# EAGLE design gatorBytes_Sensor_board (EAGLE 9.1.0)
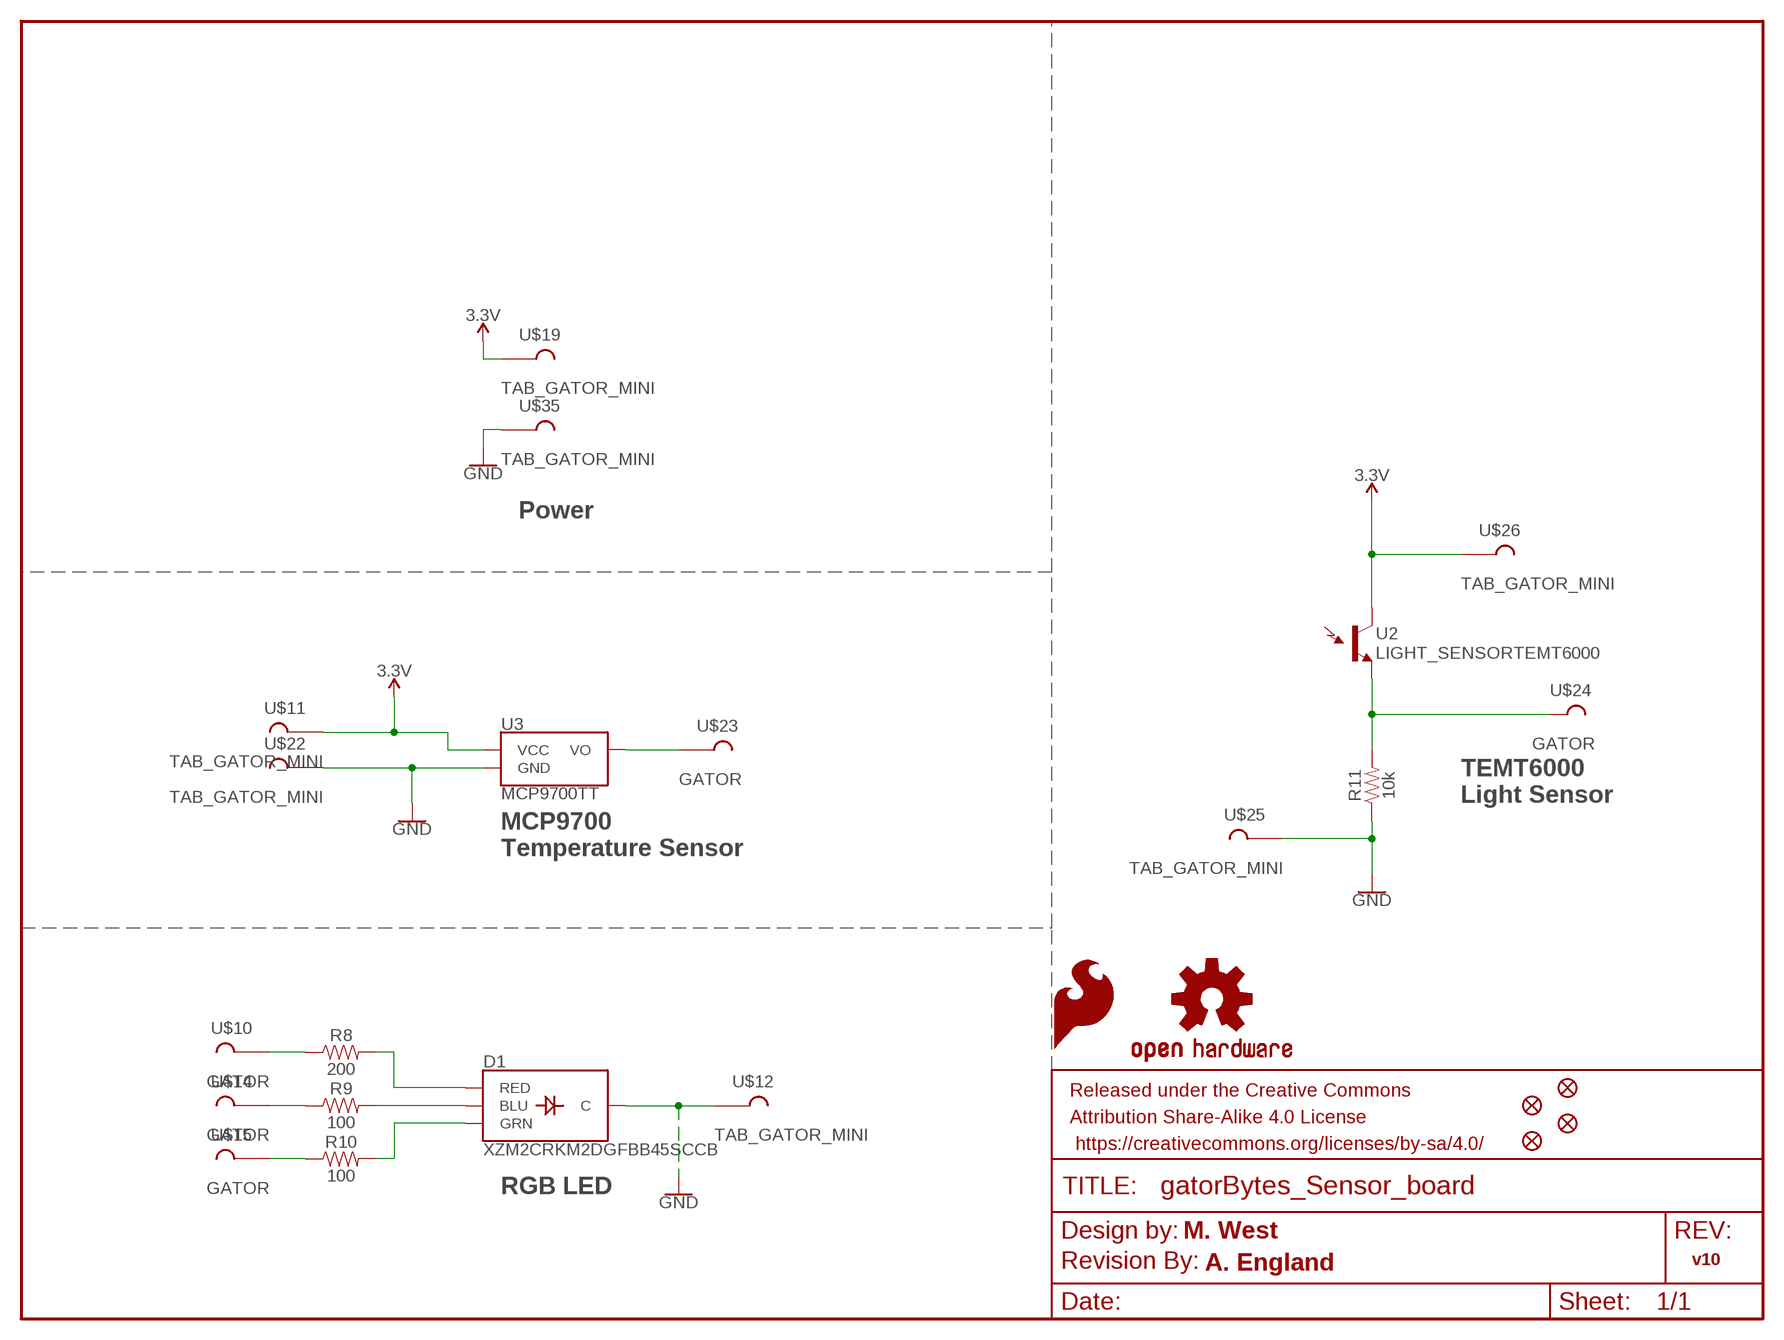
[diagram p0: schematic, sheet 1]

## Parts
D1  XZM2CRKM2DGFBB45SCCB  SUNLEDSMD1  [PLCC4SMDLED]
FD1  FIDUCIALUFIDUCIAL  [FIDUCIAL-MICRO]
FD2  FIDUCIALUFIDUCIAL  [FIDUCIAL-MICRO]
FD3  FIDUCIALUFIDUCIAL  [FIDUCIAL-MICRO]
FD4  FIDUCIALUFIDUCIAL  [FIDUCIAL-MICRO]
FRAME1  FRAME-LETTER  [CREATIVE_COMMONS]
LOGO1  SFE_LOGO_FLAME.1_INCH  [SFE_LOGO_FLAME_.1]
LOGO2  OSHW-LOGOS  [OSHW-LOGO-S]
LOGO7  REVISION  [REVISION]
R8  200  200OHM-0603-1/10W-1%  [0603]
R9  100  100OHM-0603-1/4W-5%  [0603]
R10  100  100OHM-0603-1/4W-5%  [0603]
R11  10k  10KOHM-0603-1/10W-1%  [0603]
U2  LIGHT_SENSORTEMT6000  [TEMT6000]
U3  MCP9700TT  [SOT23-3]
U$10  GATOR  [GATOR]
U$11  TAB_GATOR_MINI  [TAB_GATOR_MINI]
U$12  TAB_GATOR_MINI  [TAB_GATOR_MINI]
U$14  GATOR  [GATOR]
U$15  GATOR  [GATOR]
U$19  TAB_GATOR_MINI  [TAB_GATOR_MINI]
U$22  TAB_GATOR_MINI  [TAB_GATOR_MINI]
U$23  GATOR  [GATOR]
U$24  GATOR  [GATOR]
U$25  TAB_GATOR_MINI  [TAB_GATOR_MINI]
U$26  TAB_GATOR_MINI  [TAB_GATOR_MINI]
U$35  TAB_GATOR_MINI  [TAB_GATOR_MINI]

## Nets
3.3V: U2.COLLECTOR(C1) U3.1(VCC) U$11.P1 U$19.P1 U$26.P1
GND: D1.4(C) R11.1 U3.3(GND) U$12.P1 U$22.P1 U$25.P1 U$35.P1
N$10: U3.2(VO) U$23.P$1 U$23.P$2
N$11: D1.3(BLU) R9.2
N$12: D1.1(RED) R8.2
N$13: D1.2(GRN) R10.2
N$14: R8.1 U$10.P$1 U$10.P$2
N$15: R9.1 U$14.P$1 U$14.P$2
N$16: R10.1 U$15.P$1 U$15.P$2
N$18: R11.2 U2.EMITTER(E1) U$24.P$1 U$24.P$2

## Notes on the sheet
- Power
- TEMT6000
  Light Sensor
- MCP9700
  Temperature Sensor
- RGB LED
- M. West
- v10
- A. England

## Library data of the parts
D1 = SparkFun-LED:SUNLED: LED-RGB Common Cathode XZM2CRKM2DGFBB45SCCB Packages: PLCC4 SparkFun Products: Lilypad Prototyping Board <[https://www.sparkfun.com/products/9264]>; PROD_ID: DIO-13722
FD1-FD4 = SparkFun-Aesthetics:FIDUCIAL: Fiducial Alignment Points Point-of-reference for pick-and-place machines and other optical instruments.
FRAME1 = SparkFun-Aesthetics:FRAME-LETTER: Schematic Frame - Letter Standard 8.5x11 US Letter frame
LOGO1 = SparkFun-Aesthetics:SFE_LOGO_FLAME: SparkFun Flame Logo This is the SparkFun flame logo. The logo on the schematic will always be the same size; the package variant is the height of the flame. Default layer for the logo on the board is tSilk.
LOGO2 = SparkFun-Aesthetics:OSHW-LOGO: Open-Source Hardware (OSHW) Logo This logo indicates the piece of hardware it is found on incorporates a OSHW license and/or adheres to the definition of open source hardware found here: http://freedomdefined.org/OSHW
LOGO7 = SparkFun-Aesthetics:REVISION: "Revision By" Text Preceding text for revisor documentation. Includes schematic text on "symbols" layer, and board text on tDoc.
R8 = SparkFun-Resistors:200OHM: 200Ω resistor A resistor is a passive two-terminal electrical component that implements electrical resistance as a circuit element. Resistors act to reduce current flow, and, at the same time, act to lower voltage levels within circuits. - Wikipedia; PROD_ID: RES-08220
R9 R10 = SparkFun-Resistors:100OHM: 100Ω resistor A resistor is a passive two-terminal electrical component that implements electrical resistance as a circuit element. Resistors act to reduce current flow, and, at the same time, act to lower voltage levels within circuits. - Wikipedia; PROD_ID: RES-12438
R11 = SparkFun-Resistors:10KOHM: 10kΩ resistor A resistor is a passive two-terminal electrical component that implements electrical resistance as a circuit element. Resistors act to reduce current flow, and, at the same time, act to lower voltage levels within circuits. - Wikipedia; PROD_ID: RES-00824
U2 = SparkFun-Sensors:LIGHT_SENSOR: Ambient Light Sensors - Phototransistors Low cost ambient light sensors, consisting of a phototransistor in miniature SMD packages. Output voltage varies with light intensity. SparkFun Products ALS-PT19 Light Sensor <https://www.sparkfun.com/products/12566> (SEN-12566) Ambient Light Sensor - TEMT6000 <https://www.sparkfun.com/products/8348> (SEN-08348) SparkFun Ambient Light Sensor Breakout - TEMT60000 <https://www.sparkfun.com/products/8688> (SEN-08688); PROD_ID: COMP-08569; SF_ID: COM-08348
U3 = SparkFun-Sensors:MCP9700: Microchip MCP9700 Analog-Output Temperature Sensor The MCP9700 can accurately measure temperature from -40C to +150C. The output of the MCP9700 is calibrated to a slope of 10mV/°C and has a DC offset of 500mV. The offset allows reading negative temperatures without the need for a negative supply. Datasheet <http://ww1.microchip.com/downloads/en/DeviceDoc/20001942F.pdf> SparkFun Products LilyPad Temperature Sensor <https://www.sparkfun.com/products/8777> (DEV-08777) SparkFun Digital Sandbox <https://www.sparkfun.com/products/12651> (DEV-12651); PROD_ID: IC-08917
U$10 U$14 U$15 U$23 U$24 = SparkFun-Connectors:GATOR
U$11 U$12 U$19 U$22 U$25 U$26 U$35 = SparkFun-Connectors:TAB_GATOR_MINI

## Board
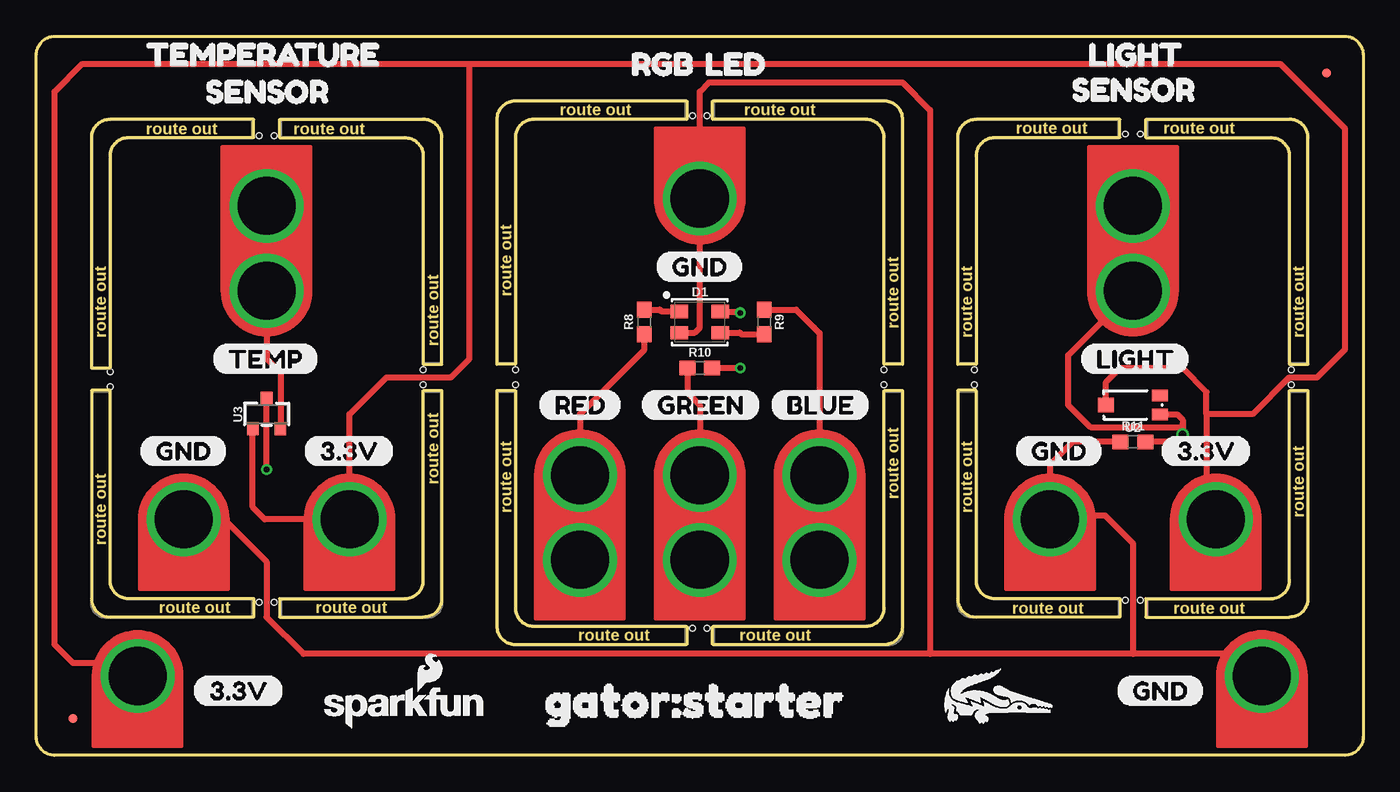
[diagram p1: board, top side]
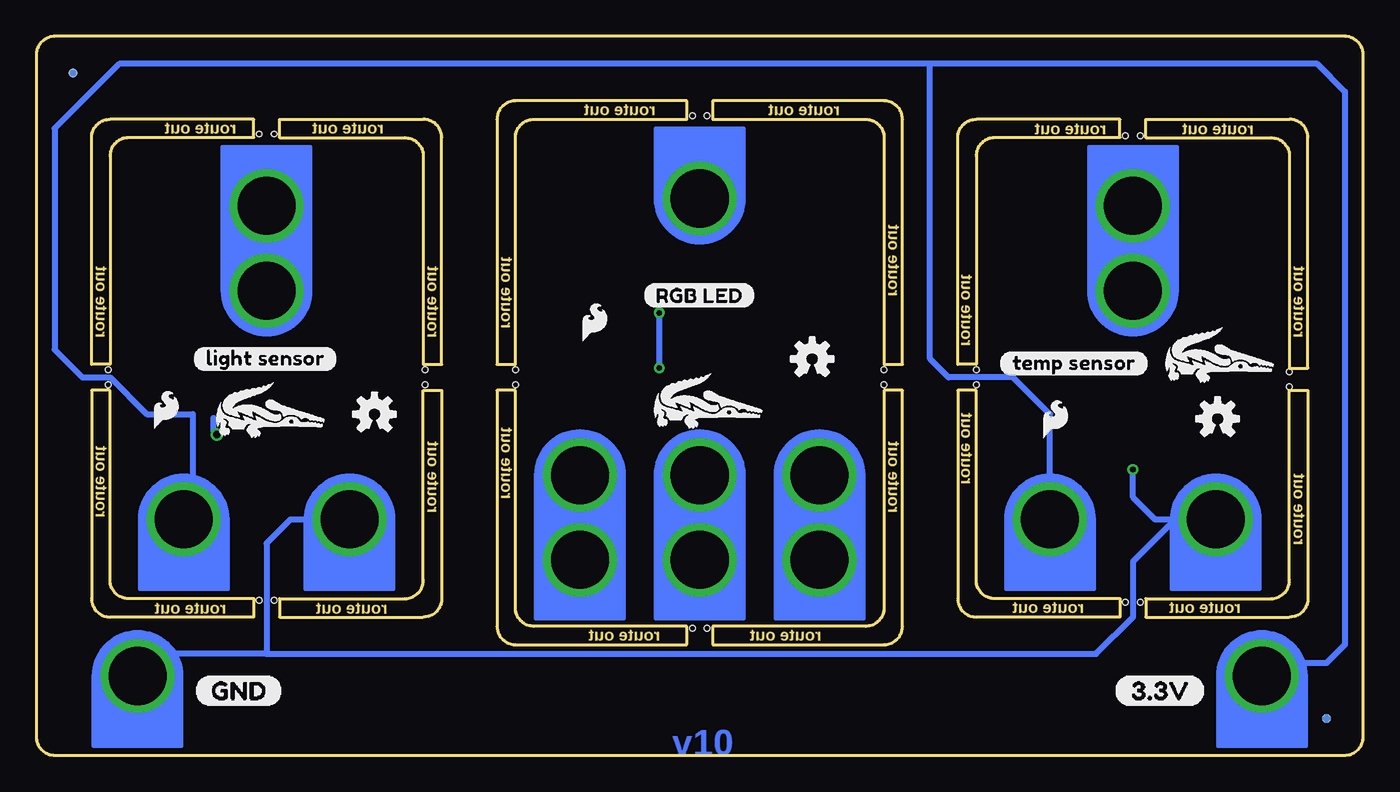
[diagram p2: board, bottom side, seen from below]

Size 91.44 x 49.53 mm. Coordinates in mm from the lower left corner, seen from the top.
Outline: 46.61,8.89 57.15,8.89 arc90 58.42,10.16 58.42,25.15 59.69,25.15 59.69,8.89 arc-90 58.42,7.62 46.61,7.62 46.61,8.89
Outline: 44.83,8.89 44.83,7.62 33.02,7.62 arc-90 31.75,8.89 31.75,25.15 33.02,25.15 33.02,10.16 arc90 34.29,8.89 44.83,8.89
Outline: 44.83,43.81 34.29,43.81 arc90 33.02,42.55 33.02,26.92 31.75,26.92 31.75,43.81 arc-90 33.02,45.09 44.83,45.09 44.83,43.81
Outline: 46.61,43.81 46.61,45.09 58.42,45.09 arc-90 59.69,43.81 59.69,26.92 58.42,26.92 58.42,42.55 arc90 57.15,43.81 46.61,43.81
Outline: 16.76,10.79 16.76,9.53 26.67,9.53 arc90 27.94,10.79 27.94,25.15 26.67,25.15 26.67,12.06 arc-90 25.4,10.79 16.76,10.79
Outline: 14.99,10.79 14.99,9.53 5.08,9.53 arc-90 3.81,10.79 3.81,25.15 5.08,25.15 5.08,12.06 arc90 6.35,10.79 14.99,10.79
Outline: 14.99,42.55 14.99,43.81 5.08,43.81 arc90 3.81,42.55 3.81,26.67 5.08,26.67 5.08,41.27 arc-90 6.35,42.55 14.99,42.55
Outline: 16.76,42.55 16.76,43.81 26.67,43.81 arc-90 27.94,42.55 27.94,26.92 26.67,26.92 26.67,41.27 arc90 25.4,42.55 16.76,42.55
Outline: 76.45,10.79 76.45,9.53 86.36,9.53 arc90 87.63,10.79 87.63,25.15 86.36,25.15 86.36,12.06 arc-90 85.09,10.79 76.45,10.79
Outline: 74.68,10.79 74.68,9.53 64.77,9.53 arc-90 63.5,10.79 63.5,25.15 64.77,25.15 64.77,12.06 arc90 66.04,10.79 74.68,10.79
Outline: 74.68,42.55 74.68,43.81 64.77,43.81 arc90 63.5,42.55 63.5,26.92 64.77,26.92 64.77,41.27 arc-90 66.04,42.55 74.68,42.55
Outline: 76.45,42.55 76.45,43.81 86.36,43.81 arc-90 87.63,42.55 87.63,26.92 86.36,26.92 86.36,41.27 arc90 85.09,42.55 76.45,42.55
Outline: 1.27,0 arc-90 0,1.27 0,48.26 arc-90 1.27,49.53 90.17,49.53 arc-90 91.44,48.26 91.44,1.27 arc-90 90.17,0 1.27,0
Copper layers (1*16): Top 0.035mm / dielectric 1.5mm / Bottom 0.035mm
Design rules "SparkFun-2-layer-TIGHT": minimum track width 7mil, minimum drill 15mil, track to track 7mil, track to pad 7mil, pad to pad 7mil, via to via 7mil, smd to smd 7mil, copper to edge 7mil, drill to drill 7mil, minimum pad ring 7mil, minimum via ring 7mil, stop-mask expansion 4mil, vias tented up to drill 25mil, thermal gap 10mil
Holes 0.38 mm at 5.08,26.42 5.08,25.4 26.67,26.54 26.67,25.53 33.02,26.54 33.02,25.53 15.37,42.67 16.38,42.67 15.37,10.54 16.38,10.54 45.21,44.07 46.23,44.07 58.42,25.53 58.42,26.54 45.21,8.76 46.23,8.76 75.06,10.67 76.07,10.67 64.64,25.53 64.64,26.54 75.06,42.8 76.07,42.8 86.49,26.54 86.49,25.53

### Footprints (pad centres in the part's own frame; a part is rotated, then mirrored left to right if it is on the bottom)
PLCC4SMDLED = smd 1.2 x 0.9: 1 -1.4,0.725; 2 1.4,0.725; 3 1.4,-0.725; 4 -1.4,-0.725
FIDUCIAL-MICRO = smd 0.635 x 0.635: 1 0,0
0603 = smd 1.1 x 1: 1 -0.85,0; 2 0.85,0
TEMT6000 = smd 1.1 x 0.8: BASE -1.87,-0.65; EMITTER -1.87,0.65 | smd 1.1 x 1: COLLECTOR 1.86,0.01
SOT23-3 = smd 0.8 x 0.9: 1 -0.95,-1; 2 0.95,-1; 3 0,1.1
GATOR = drill 4 pad 5.08: P$1 0,-6.096; P$2 0,-0.254
TAB_GATOR_MINI = drill 4 pad 5.08: P1 0,4.826

### Placement (x,y rotation side)
D1  45.72,29.84 0 top
FD1  88.9,46.99 0 top
FD2  88.9,46.99 0 bottom
FD3  2.54,2.54 0 bottom
FD4  2.54,2.54 0 top
FRAME1  22.23,-9.53 0 top  (outside the outline)
LOGO1  83.63,22.16 0 bottom
LOGO2  68.14,23.5 0 bottom
LOGO3  OSHW-LOGOS  [OSHW-LOGO-S]  37.97,27.3 0 bottom
LOGO4  SFE_LOGO_FLAME.1_INCH  [SFE_LOGO_FLAME_.1]  54.1,28.19 0 bottom
LOGO5  OSHW-LOGOS  [OSHW-LOGO-S]  10.03,23.18 0 bottom
LOGO6  SFE_LOGO_FLAME.1_INCH  [SFE_LOGO_FLAME_.1]  22.35,21.53 0 bottom
LOGO7  33.78,-11.68 0 top  (outside the outline)
R8  41.91,29.84 90 top
R9  50.16,29.84 270 top
R10  45.72,26.67 0 top
R11  75.56,21.59 0 top
U2  75.56,24.13 180 top
U3  15.88,23.5 0 top
U$1  [GND0]  42.67,33.66 0 top
U$2  [3#3V1]  77.47,20.95 0 top
U$3  [3#3V1]  18.41,20.95 0 top
U$4  [BLUE10]  50.55,24.13 0 top
U$5  [SFE_LOGO_NAME_FLAME_.1]  19.43,1.78 0 top
U$6  [GND0]  7.11,20.95 0 top
U$7  [GND0]  67.44,20.95 0 top
U$8  [GREEN9]  41.66,24.13 0 top
U$9  [LIGHT4]  71.88,27.3 0 top
U$10  37.47,19.56 0 top
U$11  21.59,11.43 0 top
U$12  45.72,43.18 180 top
U$13  [TEMP3]  12.06,27.3 0 top
U$14  53.98,19.56 0 top
U$15  45.72,19.56 0 top
U$16  [SENSOR2]  10.29,45.72 0 top
U$17  [TEMPERATURE3]  6.22,48.26 0 top
U$18  [RED8]  34.54,24.13 0 top
U$19  6.99,0.64 0 top
U$20  [LIGHT4]  71.12,48.26 0 top
U$21  [SENSOR2]  69.98,45.85 0 top
U$22  10.16,11.43 0 top
U$23  15.88,31.75 180 top
U$24  75.56,31.75 180 top
U$25  69.85,11.43 0 top
U$26  81.28,11.43 0 top
U$27  [LED5]  44.7,47.62 0 top
U$28  [GATOR#PNG]  45.47,24.51 0 bottom
U$29  [GATOR#PNG]  75.63,23.88 0 bottom
U$30  [GATOR#STARTER0]  33.02,3.81 0 top
U$31  [LIGHT_SENSOR0]  80.64,27.3 0 bottom
U$32  [TEMP_SENSOR3]  25.08,26.99 0 bottom
U$33  [ORDERING_INSTRUCTIONS]  -3.81,-12.06 0 top  (outside the outline)
U$34  [RGB_LED0]  49.66,31.69 0 bottom
U$35  84.45,0.64 0 top
U$36  [3#3V1]  10.79,4.45 0 top
U$37  [3#3V1]  17.14,4.45 0 bottom
U$38  [GND0]  74.42,4.45 0 top
U$39  [GND0]  80.52,4.45 0 bottom
U$40  [RGB0]  39.62,47.62 0 top
U$41  [GATOR#PNG]  65.98,4.19 0 top
U$70  [GATOR#PNG]  10.22,27.69 0 bottom

### Tracks (layer width: path | path; a pad name or v marks a point on that pad's centre or on a via)
3.3V
  Top 0.406: U2.COLLECTOR 73.7,25.7 74.68,26.67 78.99,26.67 80.64,25.02 80.64,23.5 | 46.35,47.62 46.99,47.62 | 83.82,23.5 80.64,23.5 | 80.64,23.5 80.64,16.89 | U3.1 14.93,17.08 15.75,16.26 U$11.P1 21.59,23.5 24.13,26.04 28.57,26.04 29.84,27.3 29.84,47.62 | 83.82,23.5 80.64,23.5 | U$19.P1 6.1,6.35 2.54,6.35 1.27,7.62 1.27,45.72 3.17,47.62 29.84,47.62 | 29.84,47.62 45.72,47.62 46.99,47.62 | 46.99,47.62 85.72,47.62 90.17,43.18 90.17,27.94 88.27,26.04 86.36,26.04 83.82,23.5 | 46.99,47.62
  Bottom 0.406: U$11.P1 21.59,23.5 24.13,26.04 28.57,26.04 29.84,27.3 29.84,47.62 | U$19.P1 6.99,5.71 6.35,6.35 2.54,6.35 1.27,7.62 1.27,45.72 3.17,47.62 29.84,47.62 | 29.84,47.62 85.72,47.62 90.17,43.18 90.17,27.94 88.27,26.04 86.36,26.04 83.82,23.5 80.64,23.5 80.64,16.89 U$26.P1
GND  (via drill 0.38)
  Top 0.406: 12.95,16.26 15.88,13.34 15.88,9.53 18.41,6.99 61.59,6.99 | 70.74,16.51 73.66,16.51 75.56,14.61 75.56,6.99 | R11.1 71.44,21.59 69.85,20 U$25.P1 | v15.88,19.68 U3.3 | U$35.P1 82.93,6.99 75.56,6.99 | 75.56,6.99 61.59,6.99 | D1.4 45.38,29.12 45.72,29.46 U$12.P1 | U$12.P1 45.72,41.91 | U$12.P1 45.72,45.72 46.35,46.35 59.69,46.35 61.59,44.45 61.59,6.99
  Bottom 0.406: 12.95,16.26 15.88,13.34 15.88,9.53 18.41,6.99 75.56,6.99 | U$25.P1 73.91,16.26 75.56,14.61 75.56,6.99 | v15.88,19.68 15.88,17.78 14.35,16.26 12.95,16.26 | 75.56,6.99 82.93,6.99 U$35.P1 | 12.95,16.26 U$22.P1
N$10
  Top 0.406: 15.88,29.84 15.88,33.02 | 15.88,33.02 U$23.P$1 | U3.2 16.82,26.36 15.88,27.3 U$23.P$2 15.88,33.02
N$11
  Top 0.406: R9.2 48.6,29 48.48,29.12 D1.3
N$12
  Top 0.406: R8.2 42.97,30.7 | 42.97,30.7 | D1.1 43.09,30.57 42.97,30.7
N$13  (via drill 0.38)
  Top 0.406: v48.51,26.67 R10.2 | D1.2 48.42,30.57 v48.51,30.48
  Bottom 0.406: v48.51,30.48 v48.51,26.67
N$14
  Top 0.406: R8.1 41.91,27.94 37.47,23.5 U$10.P$2 U$10.P$1
N$15
  Top 0.406: R9.1 52.36,30.7 53.59,29.46 | 53.59,29.46 53.85,29.21 | 53.59,29.46 53.98,29.08 U$14.P$2
  Bottom 0.406: U$14.P$1 U$14.P$2 | U$14.P$2 53.98,19.68 54.61,20.32 54.61,19.94 U$14.P$2
N$16
  Top 0.406: R10.1 44.87,24.98 45.72,24.13 U$15.P$2 U$15.P$1
N$18  (via drill 0.51)
  Top 0.406: R11.2 78.49,21.59 v78.99,22.1 78.99,22.61 | U2.EMITTER 78.63,23.48 78.99,23.11 78.99,22.86 78.99,22.61 | 78.99,22.61 72.64,22.61 71.12,24.13 71.12,27.56 U$24.P$2 U$24.P$1
  Bottom 0.406: v78.99,22.1 79.25,22.35 79.25,23.24

### Text on the board
Bottom: v10
Dimension: route out | route out | route out | route out | route out | route out | route out | route out | route out | route out | route out | route out | route out | route out | route out | route out | route out | route out | route out | route out | route out | route out | route out | route out
tDocu: M. West | A. England | Solder Mask: Black Gloss